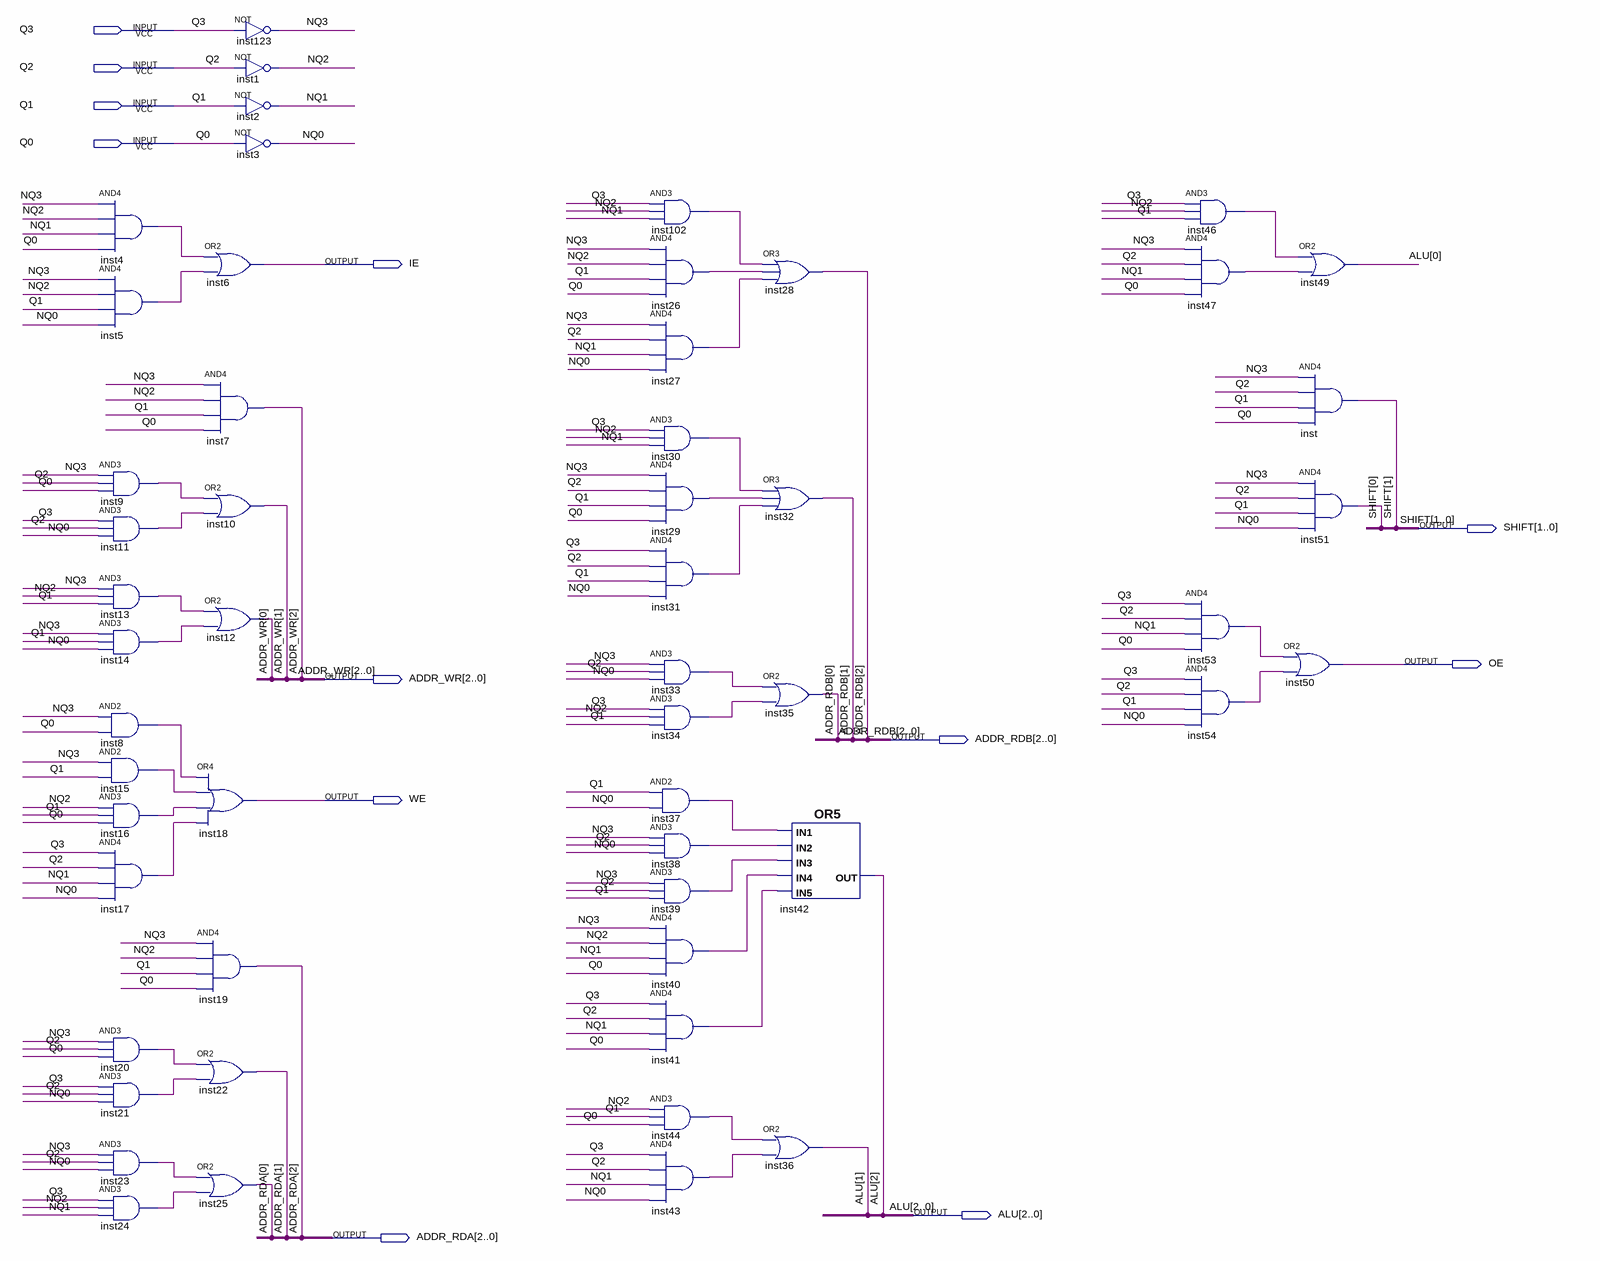
[diagram p0: schematic sheet]
// Quartus schematic TRANS.bdf as structural Verilog: 54 symbols, 12 pins
module TRANS (
  input  Q3,
  input  Q2,
  input  Q1,
  input  Q0,
  output IE,
  output [1:0] SHIFT,
  output OE,
  output [2:0] ADDR_WR,
  output [2:0] ADDR_RDB,
  output WE,
  output [2:0] ALU,
  output [2:0] ADDR_RDA
);

  wire inst4_out, inst5_out, inst8_out, inst9_out, inst11_out, inst13_out, inst14_out, inst15_out,
       inst16_out, inst17_out, inst20_out, inst21_out, inst23_out, inst24_out, inst26_out, inst27_out,
       inst29_out, inst30_out, inst31_out, inst33_out, inst34_out, inst37_out, inst38_out, inst39_out,
       inst40_out, inst41_out, inst43_out, inst44_out, inst46_out, inst47_out, inst53_out, inst54_out,
       inst102_out, NQ0, NQ1, NQ2, NQ3;

  and inst4 (inst4_out, NQ3, NQ2, NQ1, Q0);
  and inst5 (inst5_out, NQ3, NQ2, Q1, NQ0);
  and inst9 (inst9_out, NQ3, Q2, Q0);
  and inst11 (inst11_out, Q3, Q2, NQ0);
  and inst13 (inst13_out, NQ3, NQ2, Q1);
  and inst14 (inst14_out, NQ3, Q1, NQ0);
  and inst8 (inst8_out, NQ3, Q0);
  and inst15 (inst15_out, NQ3, Q1);
  and inst16 (inst16_out, NQ2, Q1, Q0);
  and inst17 (inst17_out, Q3, Q2, NQ1, NQ0);
  and inst20 (inst20_out, NQ3, Q2, Q0);
  and inst21 (inst21_out, Q3, Q2, NQ0);
  and inst23 (inst23_out, NQ3, Q2, NQ0);
  and inst24 (inst24_out, Q3, NQ2, NQ1);
  or inst6 (IE, inst4_out, inst5_out);
  and inst7 (ADDR_WR[2], NQ3, NQ2, Q1, Q0);
  or inst10 (ADDR_WR[1], inst9_out, inst11_out);
  or inst12 (ADDR_WR[0], inst13_out, inst14_out);
  or inst18 (WE, inst8_out, inst15_out, inst16_out, inst17_out);
  and inst19 (ADDR_RDA[2], NQ3, NQ2, Q1, Q0);
  or inst22 (ADDR_RDA[1], inst20_out, inst21_out);
  or inst25 (ADDR_RDA[0], inst23_out, inst24_out);
  not inst123 (NQ3, Q3);
  not inst1 (NQ2, Q2);
  not inst2 (NQ1, Q1);
  not inst3 (NQ0, Q0);
  and inst102 (inst102_out, Q3, NQ2, NQ1);
  and inst26 (inst26_out, NQ3, NQ2, Q1, Q0);
  and inst27 (inst27_out, NQ3, Q2, NQ1, NQ0);
  and inst30 (inst30_out, Q3, NQ2, NQ1);
  and inst29 (inst29_out, NQ3, Q2, Q1, Q0);
  and inst31 (inst31_out, Q3, Q2, Q1, NQ0);
  and inst33 (inst33_out, NQ3, Q2, NQ0);
  and inst34 (inst34_out, Q3, NQ2, Q1);
  and inst37 (inst37_out, Q1, NQ0);
  and inst38 (inst38_out, NQ3, Q2, NQ0);
  and inst39 (inst39_out, NQ3, Q2, Q1);
  and inst40 (inst40_out, NQ3, NQ2, NQ1, Q0);
  and inst41 (inst41_out, Q3, Q2, NQ1, Q0);
  and inst44 (inst44_out, NQ2, Q1, Q0);
  and inst43 (inst43_out, Q3, Q2, NQ1, NQ0);
  or inst28 (ADDR_RDB[2], inst102_out, inst26_out, inst27_out);
  or inst32 (ADDR_RDB[1], inst30_out, inst29_out, inst31_out);
  or inst35 (ADDR_RDB[0], inst33_out, inst34_out);
  or inst42 (ALU[2], inst37_out, inst38_out, inst39_out, inst40_out, inst41_out);
  or inst36 (ALU[1], inst44_out, inst43_out);
  and inst46 (inst46_out, Q3, NQ2, Q1);
  and inst47 (inst47_out, NQ3, Q2, NQ1, Q0);
  and inst53 (inst53_out, Q3, Q2, NQ1, Q0);
  and inst54 (inst54_out, Q3, Q2, Q1, NQ0);
  or inst50 (OE, inst53_out, inst54_out);
  or inst49 (ALU[0], inst46_out, inst47_out);
  and inst (SHIFT[1], NQ3, Q2, Q1, Q0);
  and inst51 (SHIFT[0], NQ3, Q2, Q1, NQ0);
endmodule
